# Altium schematic sheet LCD1602_Driver.SchDoc
size A4
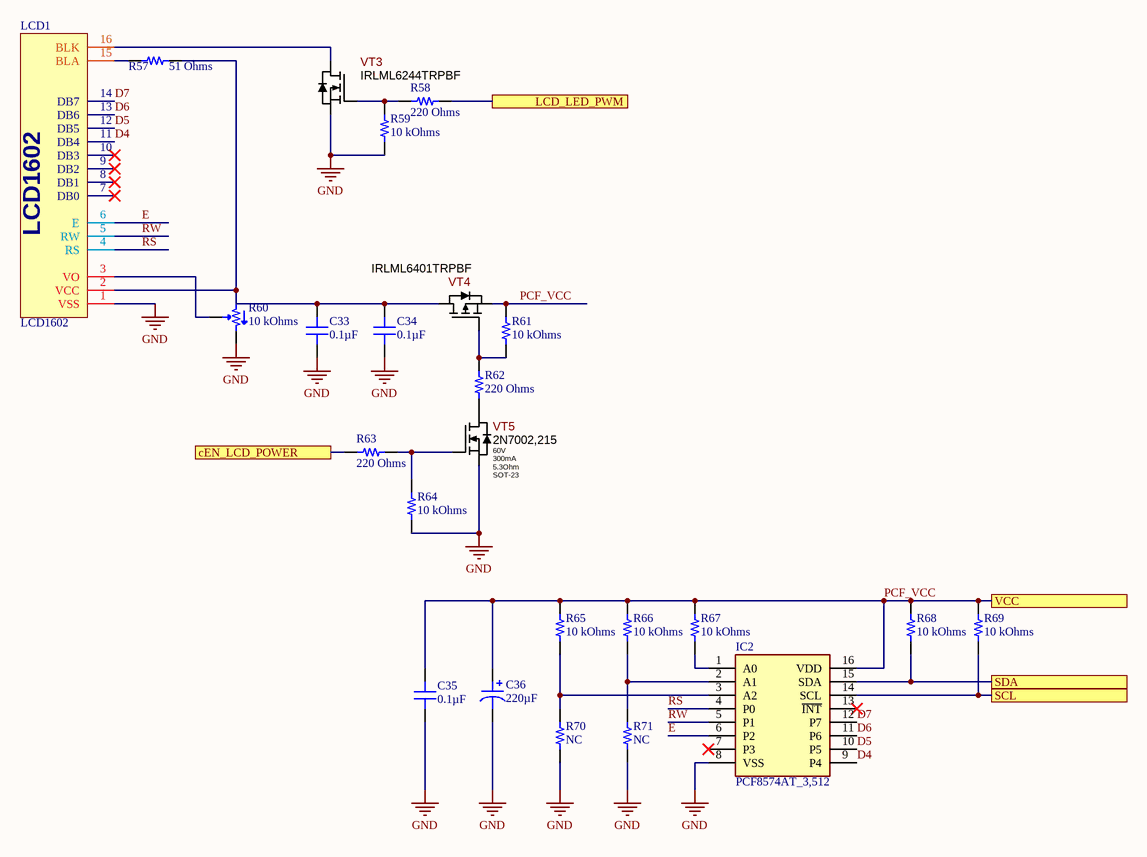
[diagram p0: LCD1602_Driver.SchDoc]

## Parts
C33  0.1µF  [CAP 0805_2012]
C34  0.1µF  [CAP 0805_2012]
C35  0.1µF  [CAP 0805_2012]
C36  220µF  [CAP ALSMD POLY 5.3MM H6.0MM]
IC2  PCF8574AT_3,512  [SOIC127P1032X265-16N]
LCD1  LCD1602  [LCD1602]
R57  51 Ohms  [RES 0805_2012]
R58  220 Ohms  [RES 0805_2012]
R59  10 kOhms  [RES 0805_2012]
R60  10 kOhms  [POT BOURNS TRIMPOT TC33]
R61  10 kOhms  [RES 0805_2012]
R62  220 Ohms  [RES 0805_2012]
R63  220 Ohms  [RES 0805_2012]
R64  10 kOhms  [RES 0805_2012]
R65  10 kOhms  [RES 0805_2012]
R66  10 kOhms  [RES 0805_2012]
R67  10 kOhms  [RES 0805_2012]
R68  10 kOhms  [RES 0805_2012]
R69  10 kOhms  [RES 0805_2012]
R70  NC  [RES 0805_2012]
R71  NC  [RES 0805_2012]
VT3  IRLML6244  [SOT-23_MED]  (value not drawn)
VT4  IRLML6401  [SOT-23_MED]  (value not drawn)
VT5  Vds: 60V  Id: 300mA  Rds: 5.3Ohm  Package: SOT-23  [SOT-23_MED]  (hidden comment: 2N7002)

## Ports
cEN_LCD_POWER, LCD_LED_PWM, SCL, SDA, VCC

## Nets
GND: C33.1 C34.1 C35.1 C36.2 IC2.8(VSS) LCD1.1(VSS) R59.1 R60.3 R64.1 R70.1 R71.1 VT3.2(S) VT5.2(S)
cEN_LCD_POWER: R63.2 ; port cEN_LCD_POWER
D4: IC2.9(P4) LCD1.11(DB4)
D5: IC2.10(P5) LCD1.12(DB5)
D6: IC2.11(P6) LCD1.13(DB6)
D7: IC2.12(P7) LCD1.14(DB7)
E: IC2.6(P2) LCD1.6(E)
LCD_LED_PWM: R58.1 ; port LCD_LED_PWM
PCF_VCC: C35.2 C36.1 IC2.16(VDD) R61.2 R65.2 R66.2 R67.1 R68.2 R69.1 VT4.2(S) ; port VCC
RS: IC2.4(P0) LCD1.4(RS)
RW: IC2.5(P1) LCD1.5(RW)
SCL: IC2.14(SCL) R69.2 ; port SCL
SDA: IC2.15(SDA) R68.1 ; port SDA
NetC33_2: C33.2 C34.2 LCD1.2(VCC) R57.2 R60.1 VT4.3(D)
NetIC2_1: IC2.1(A0) R67.2
NetIC2_2: IC2.2(A1) R66.1 R71.2
NetIC2_3: IC2.3(A2) R65.1 R70.2
NetLCD1_3: LCD1.3(VO) R60.2
NetLCD1_15: LCD1.15(BLA) R57.1
NetLCD1_16: LCD1.16(BLK) VT3.3(D)
NetR58_2: R58.2 R59.2 VT3.1(G)
NetR61_1: R61.1 R62.2 VT4.1(G)
NetR62_1: R62.1 VT5.3(D)
NetR63_1: R63.1 R64.2 VT5.1(G)

Not connected (* = marked no-connect by the designer): IC2 7(P3)* 13(~{INT})*; LCD1 7(DB0)* 8(DB1)* 9(DB2)* 10(DB3)*

## Library data of the parts
C33-C35 = CC0805MRX7R9BB104: CAP CER 0.1UF 50V X7R 0805; Manufacturer: Yageo; Tolerance: ±20%; Part Number: CC0805MRX7R9BB104; Value: 0.1µF; Applications: General Purpose; Capacitance: 0.1µF; ComponentLink1Description: Datasheet; ComponentLink1URL: https://www.yageo.com/upload/media/product/productsearch/datasheet/mlcc/UPY-GPHC_X7R_6.3V-to-50V_18.pdf; ComponentLink2Description: DigiKey Link; ComponentLink2URL: http://digikey.com/product-detail/en/yageo/CC0805MRX7R9BB104/311-4351-1-ND/8025440; Device Package: 0805 (2012 Metric); LastUpdated: 02.09.2020 01:04:42; Lifecycle Status: Active; Minimum Order: 1; Mounting Type: Surface Mount, MLCC; Operating Temperature: -55°C ~ 125°C; Package / Case: 0805 (2012 Metric); Packaging: TapeAndReel; PartId: 2475; Part Status: Active; Price: 0.02; Series: CC; Size / Dimension: 0.079" L x 0.049" W (2.00mm x 1.25mm); Supplier 1: DigiKey; Supplier Part Number 1: 311-4351-1-ND; Temperature Coefficient: X7R; Thickness (Max): 0.037" (0.95mm); Voltage - Rated: 50V
C36 = 6SVPE220MW: CAP ALUM POLY 220UF 20% 6.3V SMD; Manufacturer: Panasonic Electronic Components; ESR (Equivalent Series Resistance): 15mOhm; Lifetime @ Temp.: 2000 Hrs @ 105°C; Ripple Current @ High Frequency: 3.15A @ 100kHz; Ripple Current @ Low Frequency: 157.5mA @ 120Hz; Surface Mount Land Size: 0.209" L x 0.209" W (5.30mm x 5.30mm); Type: Polymer; Part Number: 6SVPE220MW; Applications: General Purpose; Capacitance: 220µF; ComponentLink1Description: Datasheet; ComponentLink1URL: http://industrial.panasonic.com/www-cgi/jvcr13pz.cgi?E+CI+4+AAB8002+6SVPE220MW+8+WW; ComponentLink2Description: DigiKey Link; ComponentLink2URL: http://digikey.com/product-detail/en/panasonic-electronic-components/6SVPE220MW/P16836CT-ND/4834392; Device Package: Radial, Can - SMD; Height - Seated (Max): 0.236" (6.00mm); LastUpdated: 02.09.2020 01:22:07; Lifecycle Status: Active; Minimum Order: 1; Mounting Type: Surface Mount; Operating Temperature: -55°C ~ 105°C; Package / Case: Radial, Can - SMD; Packaging: TapeAndReel; PartId: 1960; Part Status: Active; Price: 0.20; Series: OS-CON™, SVPE; Size / Dimension: 0.197" Dia (5.00mm); Supplier 1: DigiKey; Supplier Part Number 1: P16836CT-ND; Tolerance: ±20%; Value: 220µF; Voltage - Rated: 6.3V
IC2 = PCF8574AT_3,512: Integrated Circuit; Manufacturer_Name: Nexperia; Manufacturer_Part_Number: PCF8574AT/3,512; Datasheet Link: https://www.nxp.com/docs/en/data-sheet/PCF8574_PCF8574A.pdf; Height: 2.65mm; Mouser Part Number: 771-PCF85AT3512; Mouser Price/Stock: https://www.mouser.com/Search/Refine.aspx?Keyword=771-PCF85AT3512; Arrow Part Number: PCF8574AT/3,512; Arrow Price/Stock: https://www.arrow.com/en/products/pcf8574at3512/nxp-semiconductors
R57 = CRM0805-FX-51R0ELF: RES SMD 51 OHM 1% 1/4W 0805; Manufacturer: Bourns Inc.; Power (Watts): 0.25W, 1/4W; Temperature Coefficient: ±100ppm/°C; Part Number: CRM0805-FX-51R0ELF; Value: 51 Ohms; ComponentLink1Description: Datasheet; ComponentLink1URL: https://www.bourns.com/docs/Product-Datasheets/CRM0805_1206_2010.pdf; ComponentLink2Description: DigiKey Link; ComponentLink2URL: http://digikey.com/product-detail/en/bourns-inc/CRM0805-FX-51R0ELF/CRM0805-FX-51R0ELFCT-ND/3592882; Composition: Thick Film; Device Package: 0805 (2012 Metric); Features: Current Sense; Height - Seated (Max): 0.024" (0.60mm); LastUpdated: 02.09.2020 01:15:23; Lifecycle Status: Active; Minimum Order: 1; Number of Terminations: 2; Operating Temperature: -55°C ~ 155°C; Package / Case: 0805 (2012 Metric); Packaging: TapeAndReel; PartId: 28118; Part Status: Active; Price: 0.01; Resistance: 51 Ohms; Series: CRM0805; Size / Dimension: 0.079" L x 0.047" W (2.00mm x 1.20mm); Supplier 1: DigiKey; Supplier Part Number 1: CRM0805-FX-51R0ELFCT-ND; Supplier Device Package: 0805; Tolerance: ±1%
R58 R62 R63 = CRGP0805F220R: CRGP 0805 220R 1%; Manufacturer: TE Connectivity Passive Product; Power (Watts): 0.333W, 1/3W; Temperature Coefficient: ±100ppm/°C; Part Number: CRGP0805F220R; Value: 220 Ohms; ComponentLink1Description: Datasheet; ComponentLink1URL: https://www.te.com/commerce/DocumentDelivery/DDEController?Action=srchrtrv&DocNm=9-1773463-9&DocType=DS&DocLang=English; ComponentLink2Description: DigiKey Link; ComponentLink2URL: http://digikey.com/product-detail/en/te-connectivity-passive-product/CRGP0805F220R/A130469CT-ND/8578301; Composition: Thick Film; Device Package: 0805 (2012 Metric); Features: Pulse Withstanding; Height - Seated (Max): 0.026" (0.65mm); LastUpdated: 02.09.2020 01:15:22; Lifecycle Status: Active; Minimum Order: 1; Number of Terminations: 2; Operating Temperature: -55°C ~ 155°C; Package / Case: 0805 (2012 Metric); Packaging: TapeAndReel; PartId: 28799; Part Status: Active; Price: 0.02; Resistance: 220 Ohms; Series: CRGP; Size / Dimension: 0.079" L x 0.049" W (2.00mm x 1.25mm); Supplier 1: DigiKey; Supplier Part Number 1: A130469CT-ND; Supplier Device Package: 0805; Tolerance: ±1%
R59 R61 R64-R69 = RNCS0805BKE10K0: RES 10K OHM 0.1% 1/10W 0805; Manufacturer: Stackpole Electronics Inc; Power (Watts): 0.1W, 1/10W; Temperature Coefficient: ±25ppm/°C; Part Number: RNCS0805BKE10K0; Value: 10 kOhms; ComponentLink1Description: Datasheet; ComponentLink1URL: https://www.seielect.com/catalog/sei-rncs_rnch.pdf; ComponentLink2Description: DigiKey Link; ComponentLink2URL: http://digikey.com/product-detail/en/stackpole-electronics-inc/RNCS0805BKE10K0/RNCS0805BKE10K0CT-ND/1800164; Composition: Thin Film; Device Package: 0805 (2012 Metric); Features: Anti-Corrosive, Automotive AEC-Q200, Moisture Resistant; Height - Seated (Max): 0.026" (0.65mm); LastUpdated: 02.09.2020 01:15:24; Lifecycle Status: Active; Minimum Order: 1; Number of Terminations: 2; Operating Temperature: -55°C ~ 155°C; Package / Case: 0805 (2012 Metric); Packaging: TapeAndReel; PartId: 27713; Part Status: Active; Price: 0.09; Ratings: AEC-Q200; Resistance: 10 kOhms; Series: RNCS; Size / Dimension: 0.079" L x 0.049" W (2.00mm x 1.25mm); Supplier 1: DigiKey; Supplier Part Number 1: RNCS0805BKE10K0CT-ND; Supplier Device Package: 0805; Tolerance: ±0.1%
R60 = TC33X-2-103E: TRIMMER 10K OHM 0.1W J LEAD TOP; Manufacturer: Bourns Inc.; Adjustment Type: Top Adjustment; Number of Turns: 1; Power (Watts): 0.1W, 1/10W; Resistive Material: Cermet; Temperature Coefficient: ±250ppm/°C; Tolerance: ±25%; Part Number: TC33X-2-103E; ComponentLink1Description: Datasheet; ComponentLink1URL: https://www.bourns.com/docs/Product-Datasheets/TC33.pdf; ComponentLink2Description: DigiKey Link; ComponentLink2URL: http://digikey.com/product-detail/en/bourns-inc/TC33X-2-103E/TC33X-103ECT-ND/612911; LastUpdated: 02.09.2020 01:21:42; Lifecycle Status: Active; Minimum Order: 1; Mounting Type: Surface Mount; Packaging: TapeAndReel; PartId: 8; Part Status: Active; Price: 0.15; Resistance: 10 kOhms; Series: Trimpot® TC33 - Open Frame; Size / Dimension: Rectangular - 0.150" x 0.142" Face x 0.047" H (3.80mm x 3.60mm x 1.20mm); Supplier 1: DigiKey; Supplier Part Number 1: TC33X-103ECT-ND; Termination Style: J Lead; Value: 10 kOhms
R70 R71 = RNCS0805BKE10K0: RES 10K OHM 0.1% 1/10W 0805; Manufacturer: Stackpole Electronics Inc; Power (Watts): 0.1W, 1/10W; Resistance: 10 kOhms; Temperature Coefficient: ±25ppm/°C; Part Number: RNCS0805BKE10K0; Value: NC; ComponentLink1Description: Datasheet; ComponentLink1URL: https://www.seielect.com/catalog/sei-rncs_rnch.pdf; ComponentLink2Description: DigiKey Link; ComponentLink2URL: http://digikey.com/product-detail/en/stackpole-electronics-inc/RNCS0805BKE10K0/RNCS0805BKE10K0CT-ND/1800164; Composition: Thin Film; Device Package: 0805 (2012 Metric); Features: Anti-Corrosive, Automotive AEC-Q200, Moisture Resistant; Height - Seated (Max): 0.026" (0.65mm); LastUpdated: 02.09.2020 01:15:24; Lifecycle Status: Active; Minimum Order: 1; Number of Terminations: 2; Operating Temperature: -55°C ~ 155°C; Package / Case: 0805 (2012 Metric); Packaging: TapeAndReel; PartId: 27713; Part Status: Active; Price: 0.09; Ratings: AEC-Q200; Series: RNCS; Size / Dimension: 0.079" L x 0.049" W (2.00mm x 1.25mm); Supplier 1: DigiKey; Supplier Part Number 1: RNCS0805BKE10K0CT-ND; Supplier Device Package: 0805; Tolerance: ±0.1%
VT3 = IRLML6244TRPBF: 20V, 6.3A max N-Channel HEXFET MOSFET, 21mOhm @ Vgs = 4.5V; Manufacturer: Infineon Technologies; Rds: 27mOhm; Ajax_1C_ID: 5903; Ajax_1C_PN: IRLML6244TRPBF. полевой транзистор; Ajax_1С_Status: Mass Production; Component Status: Released; Standard Lead Time: 15 Weeks; Replacement: NONE; GUID_1C: 6032e646-a6d2-11e4-9c1d-a45d36c4a9e5; Part Number: IRLML6244TRPBF; Vds: 20V; Id: 6.3A; Package: SOT-23; Part Type: N-Channel; Component Type: SMD; Temperature Range: -55°C ~ 150°C; ComponentLink1URL: https://www.infineon.com/dgdl/irlml6244pbf.pdf?fileId=5546d462533600a4015356686fed261f; Supplier 1: Digi-Key; Supplier Part Number 1: IRLML6244TRPBFTR-ND; Price: 0,05; ComponentLink1Description: Datasheet
VT4 = IRLML6401TRPBF: -12V, -4.3A max P-Channel HEXFET MOSFET, 50mOhm @ Vgs = -4.5V; Manufacturer: Infineon Technologies; Vds: 12V; Id: 4.3A; Rds: 125mOhm; Ajax_1C_ID: 6278; Ajax_1C_PN: IRLML6401TRPBF SOT23. полевой транзистор; Ajax_1С_Status: Mass Production; Component Status: Released; Standard Lead Time: 15 Weeks; Replacement: NONE; GUID_1C: 6c71c7cd-df67-11e4-9f89-a45d36c4a9e5; Part Number: IRLML6401TRPBF; Package: SOT-23; Part Type: P-Channel; Component Type: SMD; Temperature Range: -55°C ~ 150°C; ComponentLink1URL: https://www.infineon.com/dgdl/irlml6401pbf.pdf?fileId=5546d462533600a401535668b96d2634; Supplier 1: Digi-Key; Supplier Part Number 1: IRLML6401PBFCT-ND; Price: 0,051; ComponentLink1Description: Datasheet
VT5 = 2N7002,215: 60V, 300mA max N-Channel Trench MOSFET, 3.8Ohm @ Vgs = 4.5V; Manufacturer: Nexperia USA Inc.; Ajax_1C_ID: 8875; Ajax_1C_PN: 2N7002.215 , NXP полевой транзистор; Ajax_1С_Status: Mass Production; Component Status: Released; Standard Lead Time: 4 Weeks; Replacement: NONE; GUID_1C: 4d2e7416-6b97-11e6-8203-d8cb8a9acc66; Part Type: N-Channel; Component Type: SMD; Temperature Range: -65°C ~ 150°C; ComponentLink1URL: https://assets.nexperia.com/documents/data-sheet/2N7002.pdf; Supplier 1: Digi-Key; Supplier Part Number 1: 1727-2764-2-ND; Price: 0,03; ComponentLink1Description: Datasheet; Part Number: 2N7002,215